# Altium schematic sheet PLD_Thermometers_PT1000.SchDoc: Thermometers
size A4; SheetTotal: 32
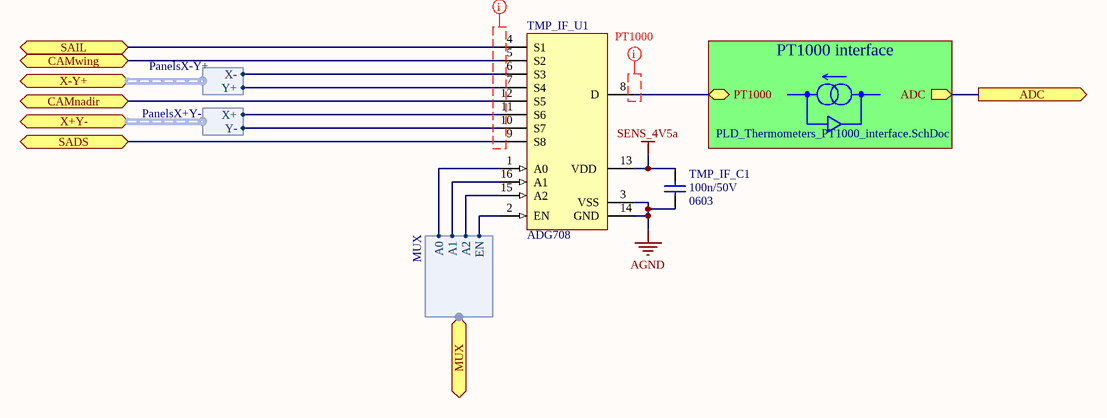
[diagram p0: PLD_Thermometers_PT1000.SchDoc]

## Parts
TMP_IF_C1  Package: 0603  [SMD_Capacitor_0603]  (hidden comment: 100n/50V)
TMP_IF_U1  ADG708  [TSSOP16]

## Sub-sheets
PT1000 interface = PLD_Thermometers_PT1000_interface.SchDoc: ADC (out), PT1000 (bidir)

## Ports
ADC (out), CAMnadir, CAMwing, MUX (harness MUX), SADS, SAIL, X+Y- (harness PanelsX+Y-), X-Y+ (harness PanelsX-Y+)

## Harnesses
MUX: A0, A1, A2, EN
PanelsX+Y-: X+, Y-
PanelsX-Y+: X-, Y+

## Nets
AGND: TMP_IF_C1.2 TMP_IF_U1.3(VSS) TMP_IF_U1.14(GND)
SENS_4V5a: TMP_IF_C1.1 TMP_IF_U1.13(VDD)
ADC: port ADC, sheet PT1000 interface/ADC
CAMnadir: TMP_IF_U1.12(S5) ; port CAMnadir
CAMwing: TMP_IF_U1.5(S2) ; port CAMwing
SADS: TMP_IF_U1.9(S8) ; port SADS
SAIL: TMP_IF_U1.4(S1) ; port SAIL
NetTMP_IF_U1_1: TMP_IF_U1.1(A0) ; port MUX.A0
NetTMP_IF_U1_2: TMP_IF_U1.2(EN) ; port MUX.EN
NetTMP_IF_U1_6: TMP_IF_U1.6(S3) ; port X-Y+.X-
NetTMP_IF_U1_7: TMP_IF_U1.7(S4) ; port X-Y+.Y+
NetTMP_IF_U1_8: TMP_IF_U1.8(D) ; sheet PT1000 interface/PT1000
NetTMP_IF_U1_10: TMP_IF_U1.10(S7) ; port X+Y-.Y-
NetTMP_IF_U1_11: TMP_IF_U1.11(S6) ; port X+Y-.X+
NetTMP_IF_U1_15: TMP_IF_U1.15(A2) ; port MUX.A2
NetTMP_IF_U1_16: TMP_IF_U1.16(A1) ; port MUX.A1

## Layout directives
net class PT1000: (no net found under the mark)

## Notes on the sheet
- Title:
- Project:
- Author:
- Model:
- Document Number:
- Checked by:
- Rev:
- Date:
- Approved by:
- Sheet:
- of
- File name:

## Library data of the parts
TMP_IF_C1 = Cer_C0603T104K5RALTU: Ceramic Cap Kemet COTS 100n/50V X7R 0603; Manufacturer: Kemet; ManufacturerPartNumber: C0603T104K5RALTU; Value: 100n/50V
TMP_IF_U1 = ADG708: CMOS Analog 8:1 Multiplexer; Manufacturer: Analog Devices; ManufacturerPartNumber: ADG708